# EAGLE design max2880base0 (EAGLE 7.1.0)
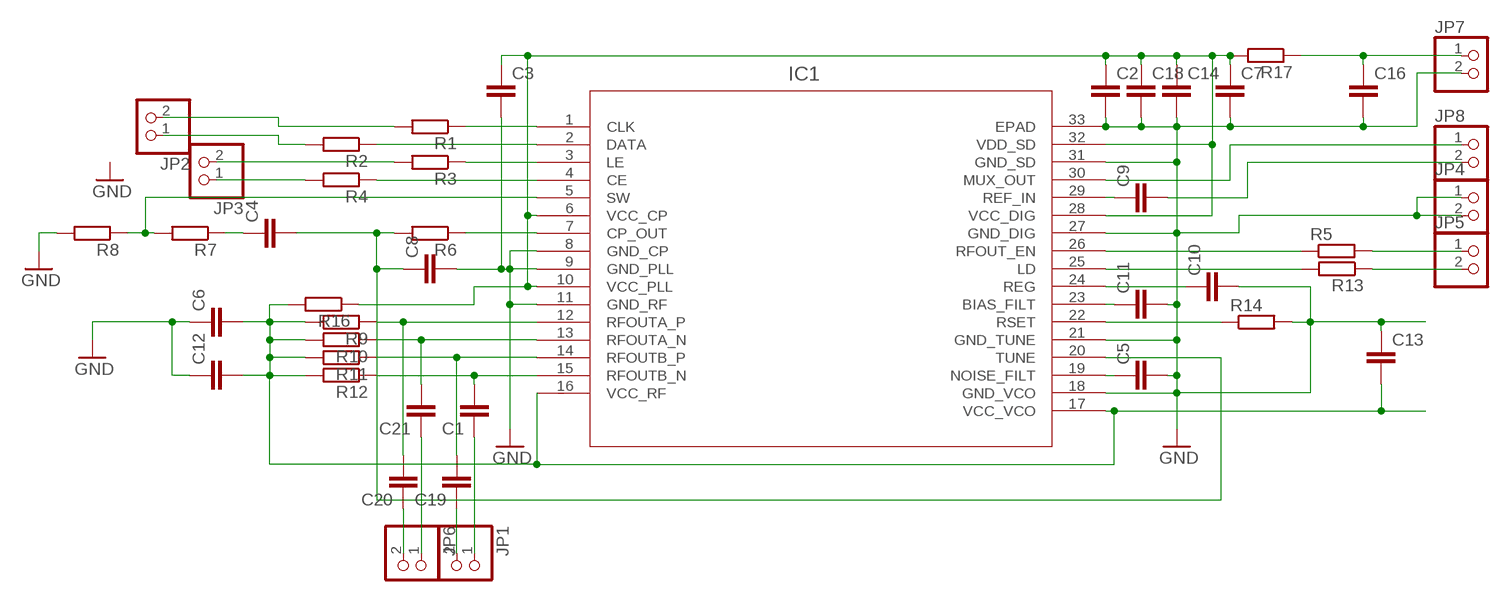
[diagram p0: schematic, sheet 1]

## Parts
C1  C-EUC0805  [C0805]
C2  C-EUC0805  [C0805]
C3  C-EUC0805  [C0805]
C4  C-EUC0805  [C0805]
C5  C-EUC0805  [C0805]
C6  C-EUC0805  [C0805]
C7  C-EUC0805  [C0805]
C8  C-EUC0805  [C0805]
C9  C-EUC0805  [C0805]
C10  C-EUC0805  [C0805]
C11  C-EUC0805  [C0805]
C12  C-EUC0805  [C0805]
C13  C-EUC1206  [C1206]
C14  C-EUC1206  [C1206]
C16  C-EUC1206  [C1206]
C18  C-EUC1808  [C1808]
C19  C-EUC0805  [C0805]
C20  C-EUC0805  [C0805]
C21  C-EUC0805  [C0805]
IC1  MAX2870ETJ+  [21-0140L_T3255-5]
JP1  PINHD-1X2  [1X02]
JP2  PINHD-1X2  [1X02]
JP3  PINHD-1X2  [1X02]
JP4  PINHD-1X2  [1X02]
JP5  PINHD-1X2  [1X02]
JP6  PINHD-1X2  [1X02]
JP7  PINHD-1X2  [1X02]
JP8  PINHD-1X2  [1X02]
R1  R-EU_R0805  [R0805]
R2  R-EU_R0805  [R0805]
R3  R-EU_R0805  [R0805]
R4  R-EU_R0805  [R0805]
R5  R-EU_R0805  [R0805]
R6  R-EU_R0805  [R0805]
R7  R-EU_R0805  [R0805]
R8  R-EU_R0805  [R0805]
R9  R-EU_M0805  [M0805]
R10  R-EU_M0805  [M0805]
R11  R-EU_M0805  [M0805]
R12  R-EU_M0805  [M0805]
R13  R-EU_R0805  [R0805]
R14  R-EU_R0805  [R0805]
R16  R-EU_R1206  [R1206]
R17  R-EU_R0805  [R0805]

## Nets
CE: JP3.1 R4.2
CLK: JP2.2 R1.2
DATA: JP2.1 R2.2
GND: C2.2 C3.2 C5.2 C6.1 C7.2 C8.2 C10.2 C11.2 C12.1 C13.1 C14.2 C16.2 C18.2 IC1.8(GND_CP) IC1.9(GND_PLL) IC1.11(GND_RF) IC1.18(GND_VCO) IC1.21(GND_TUNE) IC1.27(GND_DIG) IC1.31(GND_SD) IC1.33(EPAD) JP4.1 JP4.2 JP7.2 R8.2 R14.2
LD: JP5.2 R13.1
LE: JP3.2 R3.2
MUX: IC1.30(MUX_OUT) JP8.1
N$1: IC1.7(CP_OUT) R6.1
N$2: IC1.1(CLK) R1.1
N$3: IC1.5(SW) R7.2 R8.1
N$4: IC1.3(LE) R3.1
N$5: C1.1 JP1.1
N$6: C4.1 R7.1
N$7: IC1.2(DATA) R2.1
N$8: IC1.4(CE) R4.1
N$9: C20.2 IC1.12(RFOUTA_P) R9.1
N$10: C21.2 IC1.13(RFOUTA_N) R10.1
N$11: C1.2 IC1.15(RFOUTB_N) R12.1
N$12: C19.2 IC1.14(RFOUTB_P) R11.1
N$13: C19.1 JP1.2
N$14: C5.1 IC1.19(NOISE_FILT)
N$15: IC1.22(RSET) R14.1
N$16: C11.1 IC1.23(BIAS_FILT)
N$17: C10.1 IC1.24(REG)
N$18: C9.1 IC1.29(REF_IN)
N$19: C9.2 JP8.2
N$20: IC1.26(RFOUT_EN) R5.1
N$21: IC1.25(LD) R13.2
N$22: C21.1 JP6.1
N$23: C20.1 JP6.2
N$27: JP5.1 R5.2
N$30: C16.1 JP7.1 R17.1
TUNE: C4.2 C8.1 IC1.20(TUNE) R6.2
VCCDIG: C2.1 C3.1 C7.1 C14.1 C18.1 IC1.6(VCC_CP) IC1.10(VCC_PLL) IC1.28(VCC_DIG) IC1.32(VDD_SD) R16.1 R17.2
VCCRF: C6.2 C12.2 C13.2 IC1.16(VCC_RF) IC1.17(VCC_VCO) R9.2 R10.2 R11.2 R12.2 R16.2

## Library data of the parts
C1-C14 C16 C18-C21 = rcl:C-EU: CAPACITOR, European symbol
IC1 = muccc:MAX2870ETJ+: MAX2870 23.5 6000 MHz Synth. / VCO; MANUFACTURER_PART_NUMBER: max2870etj+; VENDOR: MAXIM
JP1-JP8 = pinhead:PINHD-1X2: PIN HEADER
R1-R14 R16 R17 = resistor:R-EU_: RESISTOR, European symbol; SPICEPREFIX: R

## Board
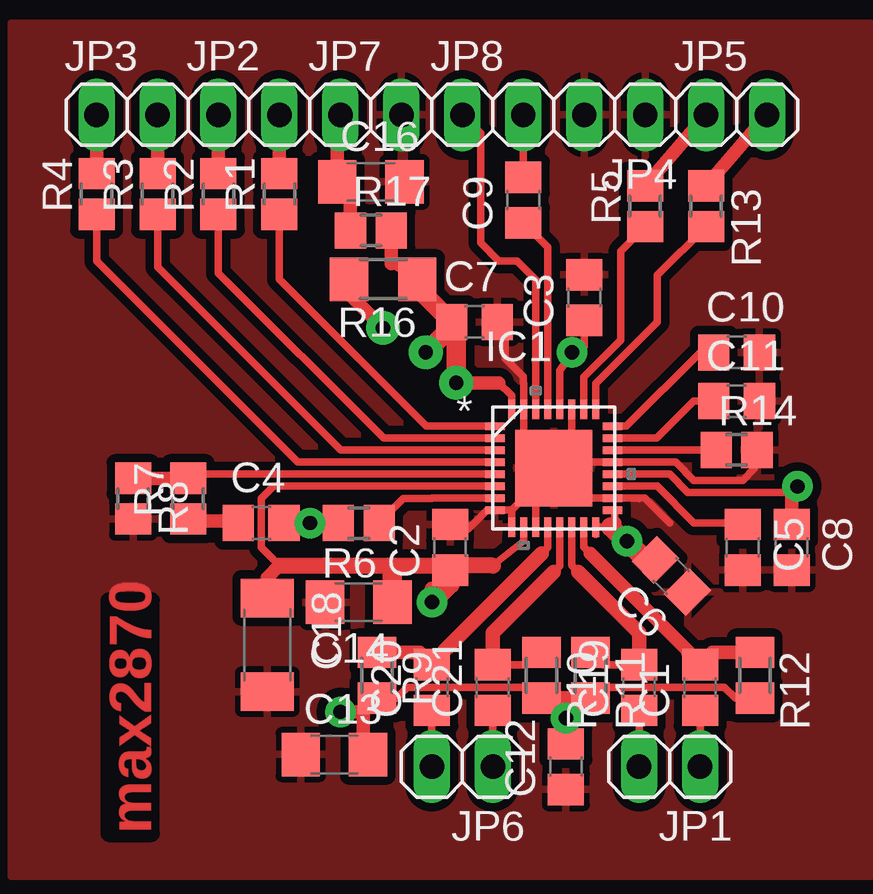
[diagram p1: board, top side]
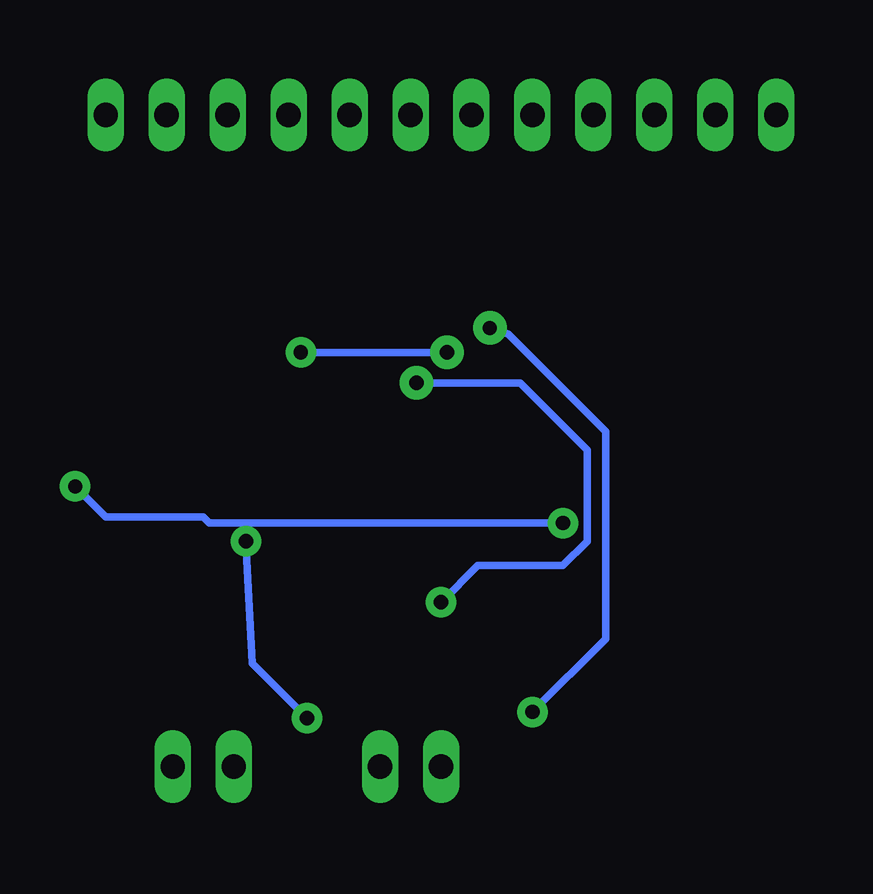
[diagram p2: board, bottom side, seen from below]

No outline drawn. Coordinates in mm, seen from the top.
Copper layers (1*16): Top 0.035mm / dielectric 1.5mm / Bottom 0.035mm
Design rules "default *": minimum track width 10mil, minimum drill 24mil, track to track 8mil, track to pad 8mil, pad to pad 8mil, via to via 8mil, smd to smd 8mil, copper to edge 40mil, drill to drill 8mil, minimum pad ring 10mil, minimum via ring 8mil, stop-mask expansion 4mil, vias tented up to drill 0mil, thermal gap 10mil

### Footprints (pad centres in the part's own frame; a part is rotated, then mirrored left to right if it is on the bottom)
C0805 = smd 1.3 x 1.5: 1 -0.95,0; 2 0.95,0
C1206 = smd 1.6 x 1.8: 1 -1.4,0; 2 1.4,0
C1808 = smd 1.6 x 2.2: 1 -1.95,0; 2 1.95,0
21-0140L_T3255-5 = smd 0.813 x 0.305: 1 -2.451,1.75; 2 -2.451,1.25; 3 -2.451,0.75; 4 -2.451,0.25; 5 -2.451,-0.25; 6 -2.451,-0.75; 7 -2.451,-1.25; 8 -2.451,-1.75; 17 2.451,-1.75; 18 2.451,-1.25; 19 2.451,-0.75; 20 2.451,-0.25; 21 2.451,0.25; 22 2.451,0.75; 23 2.451,1.25; 24 2.451,1.75 | smd 0.305 x 0.813: 9 -1.75,-2.451; 10 -1.25,-2.451; 11 -0.75,-2.451; 12 -0.25,-2.451; 13 0.25,-2.451; 14 0.75,-2.451; 15 1.25,-2.451; 16 1.75,-2.451; 25 1.75,2.451; 26 1.25,2.451; 27 0.75,2.451; 28 0.25,2.451; 29 -0.25,2.451; 30 -0.75,2.451; 31 -1.25,2.451; 32 -1.75,2.451 | smd 3.2 x 3.2: 33 0,0
1X02 = drill 1.016 long: 1 -1.27,0; 2 1.27,0
R0805 = smd 1.3 x 1.5: 1 -0.85,0; 2 0.85,0
M0805 = smd 1.3 x 1.6: 1 -0.95,0; 2 0.95,0
R1206 = smd 1.6 x 1.803: 1 -1.422,0; 2 1.422,0

### Placement (x,y rotation side)
C1  -9.14,-7.87 90 top
C2  -19.56,-2.03 90 top
C3  -13.97,8.38 90 top
C4  -27.43,-1.02 0 top
C5  -7.37,-2.03 270 top
C6  -10.34,-3.23 135 top
C7  -18.54,7.37 0 top
C8  -5.33,-2.03 270 top
C9  -16.51,12.45 90 top
C10  -7.62,6.1 0 top
C11  -7.62,4.06 0 top
C12  -14.73,-11.18 90 top
C13  -24.38,-10.67 0 top
C14  -23.37,-4.32 180 top
C16  -22.86,13.21 0 top
C18  -27.18,-6.1 270 top
C19  -11.68,-7.87 90 top
C20  -20.32,-7.87 90 top
C21  -17.78,-7.87 90 top
IC1  -15.24,1.27 0 top
JP1  -10.41,-11.18 180 top
JP2  -27.94,16 0 top
JP3  -33.02,16 0 top
JP4  -12.7,16 180 top
JP5  -7.62,16 0 top
JP6  -19.05,-11.18 180 top
JP7  -22.86,16 0 top
JP8  -17.78,16 0 top
R1  -26.67,12.7 90 top
R2  -29.21,12.7 90 top
R3  -31.75,12.7 90 top
R4  -34.29,12.7 90 top
R5  -11.43,12.19 90 top
R6  -23.37,-1.02 180 top
R7  -30.48,0 90 top
R8  -32.77,0 270 top
R9  -22.61,-7.37 270 top
R10  -15.75,-7.37 270 top
R11  -13.72,-7.37 270 top
R12  -6.86,-7.37 270 top
R13  -8.89,12.19 270 top
R14  -7.62,2.03 0 top
R16  -22.35,9.14 180 top
R17  -22.86,11.18 0 top

### Tracks (layer width: path | path; a pad name or v marks a point on that pad's centre or on a via)
CE
  Top 0.559: R4.2 JP3.1
CLK
  Top 0.559: R1.2 JP2.2
DATA
  Top 0.559: R2.2 JP2.1
GND
  Top 0.305: -14.99,1.52 IC1.21 -10.16,1.52 -9.4,0.76 -7.37,0.76 -6.86,1.27 -6.86,1.94 R14.2 | -14.99,1.52 IC1.33 -16,0.51 -16,0 | IC1.11 -15.99,-0.01 -16,0 | IC1.9 -16.99,-0.48 | -16.99,-0.48 -16.51,0 -16,0 | -16.99,-0.48 IC1.8 -18.01,-0.48 -18.8,-1.27 -18.98,-1.08 C2.2 | IC1.18 -13.95,0.02 -13.97,0 | IC1.18 -11.7,0.02 -11.68,0 | IC1.27 -14.49,2.55 | -14.49,2.55 -14.48,2.54 | -16.49,2.56 IC1.31 -16.49,4.81 -16.51,4.83 -16.51,5.08 -17.27,5.84 -17.27,7.3 C7.2 | -16.49,2.56 -16.51,2.54 | -14.99,1.52 -14.99,1.78 | -14.99,1.78 -14.99,2.05 -14.49,2.55 | -16.49,2.56 -15.77,2.56 -14.99,1.78 | IC1.18 -11.45,0.02 -10.41,-1.02 | -14.48,9.65 -14.49,9.64 -14.28,9.64 C3.2 -14.16,9.33
  pour Top (isolate 0.356): -37.85,19.81 -2.03,19.81 -2.03,-15.75 -37.85,-15.75
LD
  Top 0.559: R13.1 JP5.2
LE
  Top 0.559: R3.2 JP3.2
MUX
  Top 0.305: IC1.30 -15.99,9.13 -16.76,9.91 -17.53,9.91 -18.29,10.67 -18.29,15.24 JP8.1
N$1
  Top 0.305: IC1.7 -20.3,0.02 -20.32,0 -21.5,0 R6.1
N$2
  Top 0.305: IC1.1 -20.55,3.02 -26.67,9.14 R1.1
N$3
  Top 0.305: IC1.5 -30.31,1.02 R7.2
  Top 0.559: R7.2 R8.1
N$4
  Top 0.305: IC1.3 -24.12,2.02 -31.75,9.65 R3.1
N$5
  Top 0.305: JP1.1 C1.1
N$6
  Top 0.305: -28.47,-0.93 C4.1 | -30.4,-0.93 R7.1
  Top 0.559: -28.47,-0.93 -30.4,-0.93
N$7
  Top 0.305: IC1.2 -22.33,2.52 -29.21,9.4 R2.1
N$8
  Top 0.305: IC1.4 -25.9,1.52 -34.29,9.91 R4.1
N$9
  Top 0.305: IC1.12 -15.49,-2.03 -15.75,-2.29 | -19.81,-6.35 -19.81,-6.42 C20.2
  Top 0.559: R9.1 -20.83,-6.42 C20.2
  Top 0.61: -15.75,-2.29 -19.81,-6.35
N$10
  Top 0.305: C21.2 -16.51,-6.92 R10.1 | IC1.13 -14.99,-2.8 -15.24,-3.05
  Top 0.61: -15.24,-3.05 -17.78,-5.59 C21.2
N$11
  Top 0.305: IC1.15 -13.99,-2.01 -13.72,-2.29 | -9.65,-6.35 -9.65,-6.42
  Top 0.559: R12.1 -8.64,-6.42 C1.2 -9.65,-6.42 | -13.72,-2.29 -9.65,-6.35
N$12
  Top 0.305: C19.2 -13.21,-6.92 R11.1 | IC1.14 -14.49,-2.78 -14.22,-3.05
  Top 0.61: -14.22,-3.05 -11.68,-5.59 C19.2
N$13
  Top 0.305: C19.1 JP1.2
N$14
  Top 0.305: IC1.19 -10.93,0.52 -9.4,-1.02 -7.43,-1.02 C5.1
N$15
  Top 0.305: IC1.22 -9.22,2.02 R14.1
N$16
  Top 0.305: IC1.23 -10.94,2.52 -9.4,4.06 C11.1
N$17
  Top 0.305: IC1.24 -12.22,3.02 -9.14,6.1 C10.1
N$18
  Top 0.305: IC1.29 -15.49,10.48 C9.1
N$19
  Top 0.305: C9.2 JP8.2
N$20
  Top 0.305: IC1.26 -13.99,5.06 -12.45,6.6 -12.45,10.33 R5.1
N$21
  Top 0.305: IC1.25 -13.49,4.8 -10.92,7.37 -10.92,9.31 R13.2
N$22
  Top 0.305: C21.1 JP6.1
N$23
  Top 0.305: C20.1 JP6.2
N$27
  Top 0.559: R5.2 JP5.1
N$30
  Top 0.305: -23.71,12.66 C16.1 | -24.26,15.87 JP7.1
  Top 0.559: R17.1 -23.71,12.66 | C16.1 -24.26,15.87
TUNE  (via drill 0.6 pad 1.27)
  Top 0.305: R6.2 v-25.4,-1.02 | IC1.20 -10.42,1.02 -9.65,0.25 -5.33,0.25
  Top 0.559: v-25.4,-1.02 C4.2 | C8.1 -5.33,0.25 v-5.08,0.51
  Bottom 0.305: v-25.4,-1.02 -10.67,-1.02 -10.41,-0.76 -6.35,-0.76 v-5.08,0.51
VCCDIG  (via drill 0.6 pad 1.27, 0.6 pad 1.4)
  Top 0.305: IC1.10 -16.49,-1.76 -17.78,-2.79 | -26.67,-2.79 -27.43,-2.03 -27.43,0 -26.91,0.52 IC1.6 | -19.56,-2.79 C2.1 | IC1.28 -14.99,5.33 v-14.48,6.1 -13.97,6.35 C3.1 | -21.97,-2.92 -21.84,-2.79 | -22.01,9.79 R16.1 | IC1.32 -16.99,4.29 -17.53,4.83
  Top 0.559: C18.1 -27.18,-3.3 -26.67,-2.79 | R17.2 -22.01,9.79 | -17.53,4.83 v-19.3,4.83 | v-20.32,-4.32 -20.32,-3.74
  Top 0.66: -26.67,-2.79 -21.84,-2.79 -19.56,-2.79 -17.78,-2.79
  Top 0.813: R16.1 -20.93,8.8 C7.1 | C7.1 -19.49,7.18 v-20.57,6.1 | v-19.3,4.83 -19.3,7.18 C7.1 | C2.1 -19.56,-3.56 v-20.32,-4.32 | C14.1 -21.97,-2.92
  Bottom 0.305: v-14.48,6.1 v-20.57,6.1 | v-19.3,4.83 -23.62,4.83 -26.42,2.03 -26.42,-1.78 -25.4,-2.79 -21.84,-2.79 v-20.32,-4.32
VCCRF  (via drill 0.6 pad 1.27, 0.6 pad 1.4)
  Top 0.305: -13.49,-1.5 IC1.16 -12.87,-1.18 | -12.7,-1.02 -12.7,-0.57 IC1.17 | R12.2 -7.69,-8.32 -8.13,-7.87 -13.27,-7.87 R11.2 | v-14.73,-9.14 -14.73,-8.82 -15.24,-8.32 R10.2 -16.19,-7.87 -21.34,-7.87 -21.78,-8.32 R9.2 -23.18,-8.89 | R16.2 -23.85,8.61 | -23.18,-10.47 C13.2
  Top 0.559: -12.87,-1.18 -12.7,-1.02 | -15.24,-8.32 R11.2 | v-14.73,-9.14 C12.2 | -23.85,8.61 v-22.35,7.11 | v-24.13,-8.89 -23.18,-8.89 -23.18,-10.47
  Top 0.813: -12.87,-1.18 -12.27,-1.78 v-12.19,-1.78 -11.43,-2.54 -11.03,-2.54 C6.2
  Bottom 0.305: v-12.19,-1.78 -12.45,-6.86 v-14.73,-9.14 | v-22.35,7.11 -23.11,6.86 -27.18,2.79 -27.18,-5.84 v-24.13,-8.89

### Text on the board
Top: max2870